# EAGLE design Dynamug PCB Final Draft (EAGLE 9.6.2)
AUTHOR: Lucas and Garret; BOARD_NAME: Final PCB Draft; DOC_NUM: 1; PROJECT_NAME: DYNAMUG; REVISION: 1.1
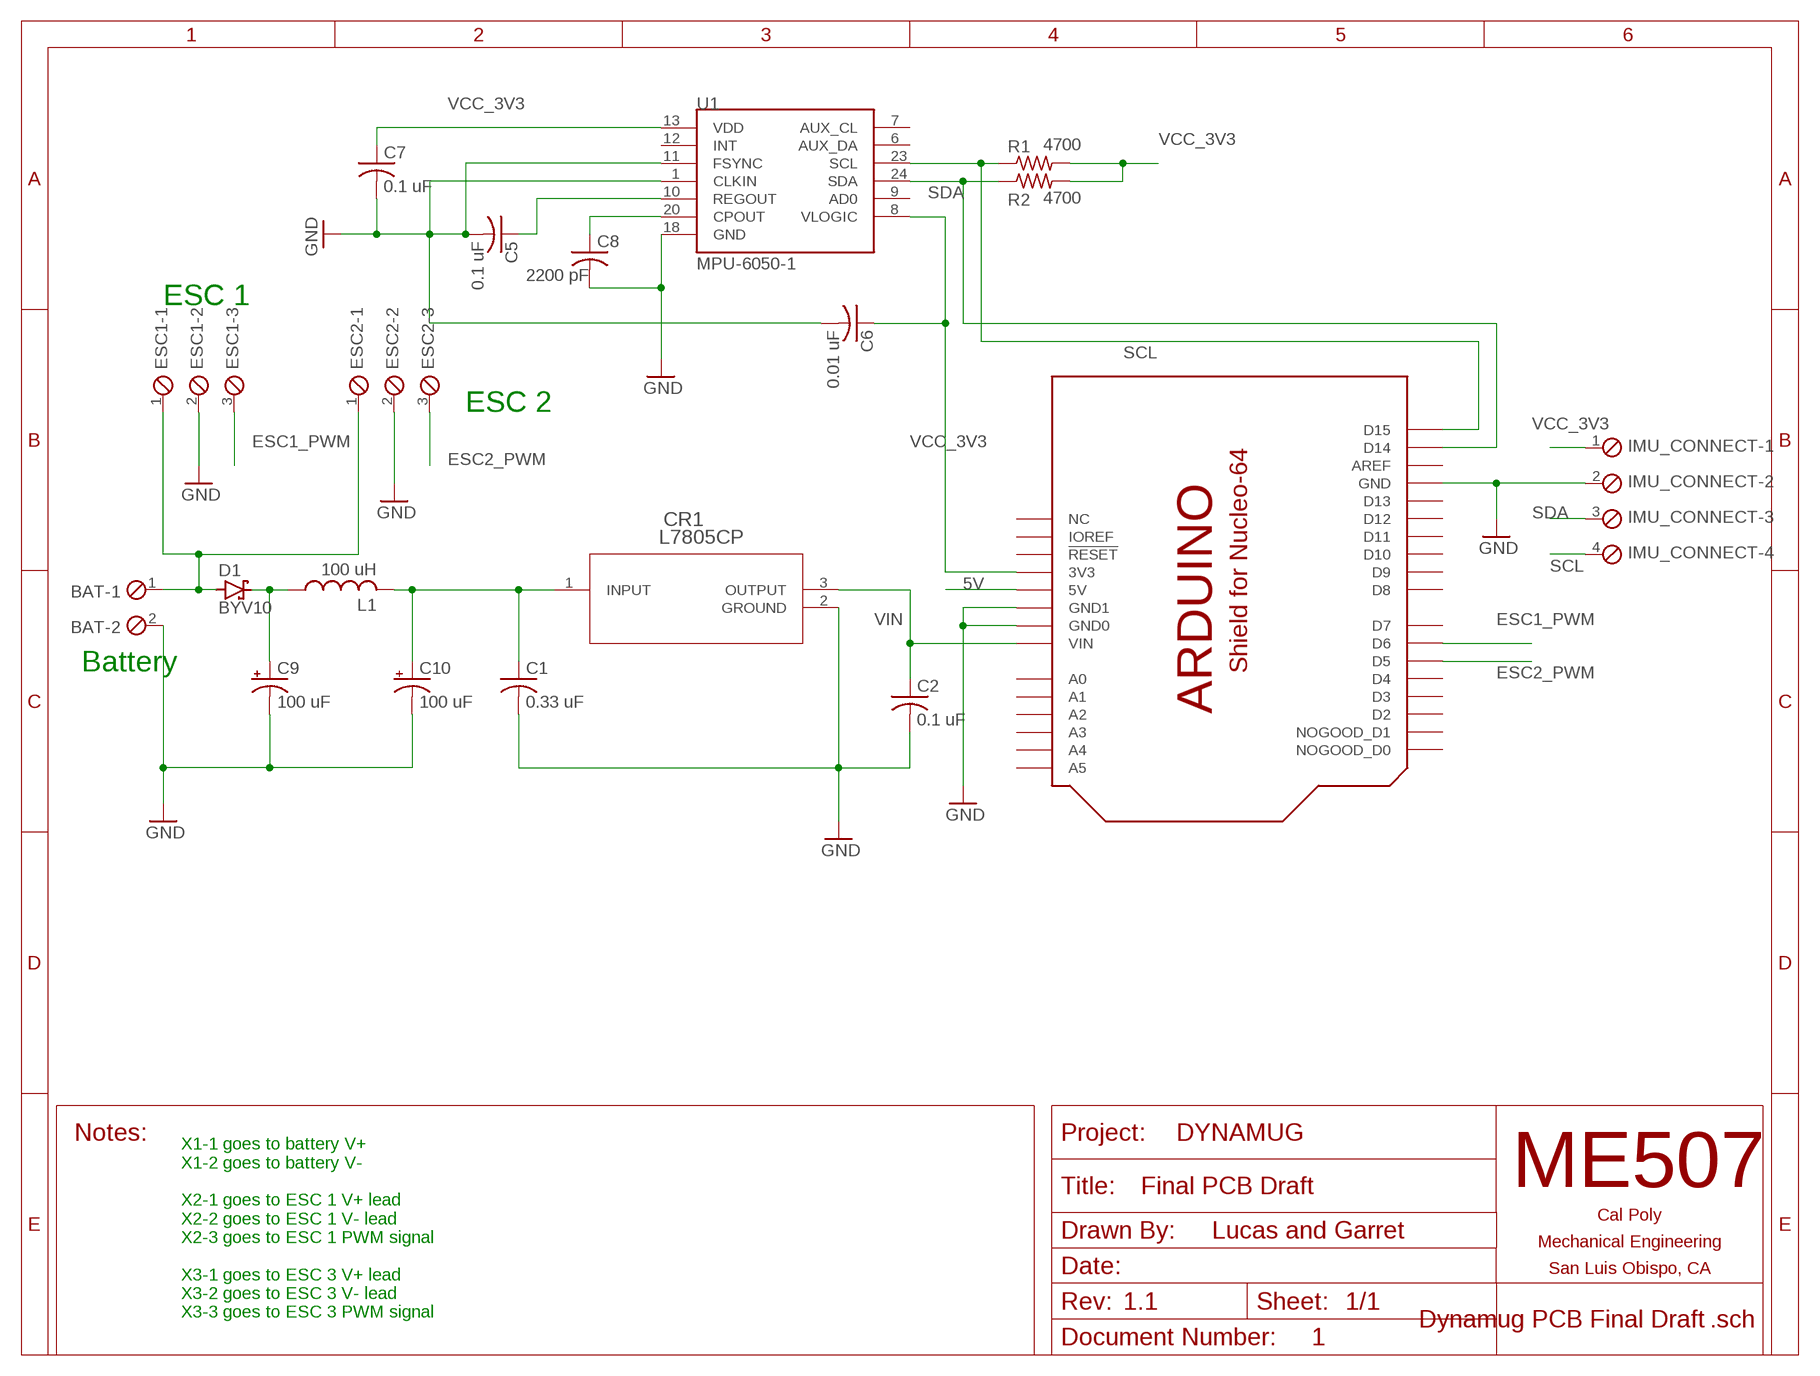
[diagram p0: schematic, sheet 1]

## Parts
BAT  SCREWTERM_2P_381  [2POL381]
C1  0.33 uF  C-USC0805  [C0805]
C2  0.1 uF  C-USC0805  [C0805]
C5  0.1 uF  C-USC0805  [C0805]
C6  0.01 uF  C-USC0805  [C0805]
C7  0.1 uF  C-USC0805  [C0805]
C8  2200 pF  C-USC0805  [C0805]
C9  100 uF  CPOL-USE2.5-6  [E2,5-6]
C10  100 uF  CPOL-USE2.5-6  [E2,5-6]
CR1  L7805CP  [TO-220FP_STM]
D1  BYV10  [DO41-10]
ESC1  SCREWTERM_3P_381  [3POL381]
ESC2  SCREWTERM_3P_381  [3POL381]
IMU_CONNECT  SCREWTERM_4P_381  [4POL381]
L1  100 uH  L-USLAL03  [LAL03]
R1  4700  R-US_R2010  [R2010]
R2  4700  R-US_R2010  [R2010]
U1  MPU-6050-1  [QFN-24-4MM2]
U$1  SHIELD_FOR_NUCLE0_64_SHORT  [SHIELD_FOR_NUCLEO_64_SHORT]

## Nets
5V: U$1.5V
ESC1_PWM: ESC1.3 U$1.D6
ESC2_PWM: ESC2.3 U$1.D5
GND: BAT.2 C1.2 C2.2 C5.2 C6.2 C7.2 C8.2 C9.- C10.- CR1.2(GROUND) ESC1.2 ESC2.2 IMU_CONNECT.2 U1.1(CLKIN) U1.11(FSYNC) U1.18(GND) U$1.GND U$1.GND1(GND0) U$1.GND2(GND1)
N$1: C1.1 C10.+ CR1.1(INPUT) L1.2
N$2: C9.+ D1.C L1.1
N$4: C5.1 U1.10(REGOUT)
N$5: C8.1 U1.20(CPOUT)
SCL: IMU_CONNECT.4 R1.1 U1.23(SCL) U$1.D15
SDA: IMU_CONNECT.3 R2.1 U1.24(SDA) U$1.D14
V_BAT: BAT.1 D1.A ESC1.1 ESC2.1
VCC_3V3: C6.1 C7.1 IMU_CONNECT.1 R1.2 R2.2 U1.8(VLOGIC) U1.13(VDD) U$1.3V(3V3)
VIN: C2.1 CR1.3(OUTPUT) U$1.VIN
Unconnected: U1.6(AUX_DA) U1.7(AUX_CL) U1.9(AD0) U1.12(INT) U$1.A0 U$1.A1 U$1.A2 U$1.A3 U$1.A4 U$1.A5 U$1.AREF U$1.D0(NOGOOD_D0) U$1.D1(NOGOOD_D1) U$1.D2 U$1.D3 U$1.D4 U$1.D7 U$1.D8 U$1.D9 U$1.D10 U$1.D11 U$1.D12 U$1.D13 U$1.IOREF U$1.NC U$1.NRST(!RESET)

## Notes on the sheet
- ESC 1
- ESC 2
- Battery
- X1-1 goes to battery V+
  X1-2 goes to battery V-
  
  X2-1 goes to ESC 1 V+ lead
  X2-2 goes to ESC 1 V- lead
  X2-3 goes to ESC 1 PWM signal
  
  X3-1 goes to ESC 3 V+ lead
  X3-2 goes to ESC 3 V- lead
  X3-3 goes to ESC 3 PWM signal

## Library data of the parts
BAT = ME507:SCREWTERM_2P: Screw Terminal Block This part is designed for a screw terminal connector. The 2.54mm (0.100 inch) foorprint can also be used for male or female pin headers such as those on most development boards. One can also solder wires directly into the holes, though this makes modifications or repairs to the system more inconvenient. Larger versions can carry more current.
C1 C2 C5-C8 = rcl:C-US: CAPACITOR, American symbol; SPICEPREFIX: C
C9 C10 = rcl:CPOL-US: POLARIZED CAPACITOR, American symbol; SPICEPREFIX: C
CR1 = LM7805:L7805CP; COPYRIGHT: Copyright (C) 2021 Ultra Librarian. All rights reserved.; MANUFACTURER_PART_NUMBER: L7805CP; MFR_NAME: STMicroelectronics
D1 = diode:BYV10: DIODE power diode
ESC1 ESC2 = ME507:SCREWTERM_3P: Screw Terminal Block This part is designed for a screw terminal connector. The 2.54mm (0.100 inch) foorprint can also be used for male or female pin headers such as those on most development boards. One can also solder wires directly into the holes, though this makes modifications or repairs to the system more inconvenient. Larger versions can carry more current.
IMU_CONNECT = ME507:SCREWTERM_4P: Screw Terminal Block This part is designed for a screw terminal connector. The 2.54mm (0.100 inch) foorprint can also be used for male or female pin headers such as those on most development boards. One can also solder wires directly into the holes, though this makes modifications or repairs to the system more inconvenient. Larger versions can carry more current.
L1 = rcl:L-US: INDUCTOR, American symbol; SPICEPREFIX: L
R1 R2 = rcl:R-US_: RESISTOR, American symbol; SPICEPREFIX: R
U1 = Testing:MPU-6050
U$1 = ME507:SHIELD_FOR_NUCLE0_64: Arduino Style Shield for Nucleo-64 This is a board outline with pin locations for an Arduino style shield which fits on top of an STM32 Nucleo-64. Pin names are generic except for Nucleo specific pins such as IOREF. There are two board sizes, the standard which matches the size of an Arduino Uno, and the short version which can be less expensive to produce if you don't need a lot of board area. The outline is on the DIMENSION layer. When making a new board, you must delete the lines which form the default board outline so that this package's outlines control the dimensions of the board. Pins D0 and D1 are connected to a communications port and are not available for general use, so they are labeled as NOGOOD on the symbol and footprints.

## Board
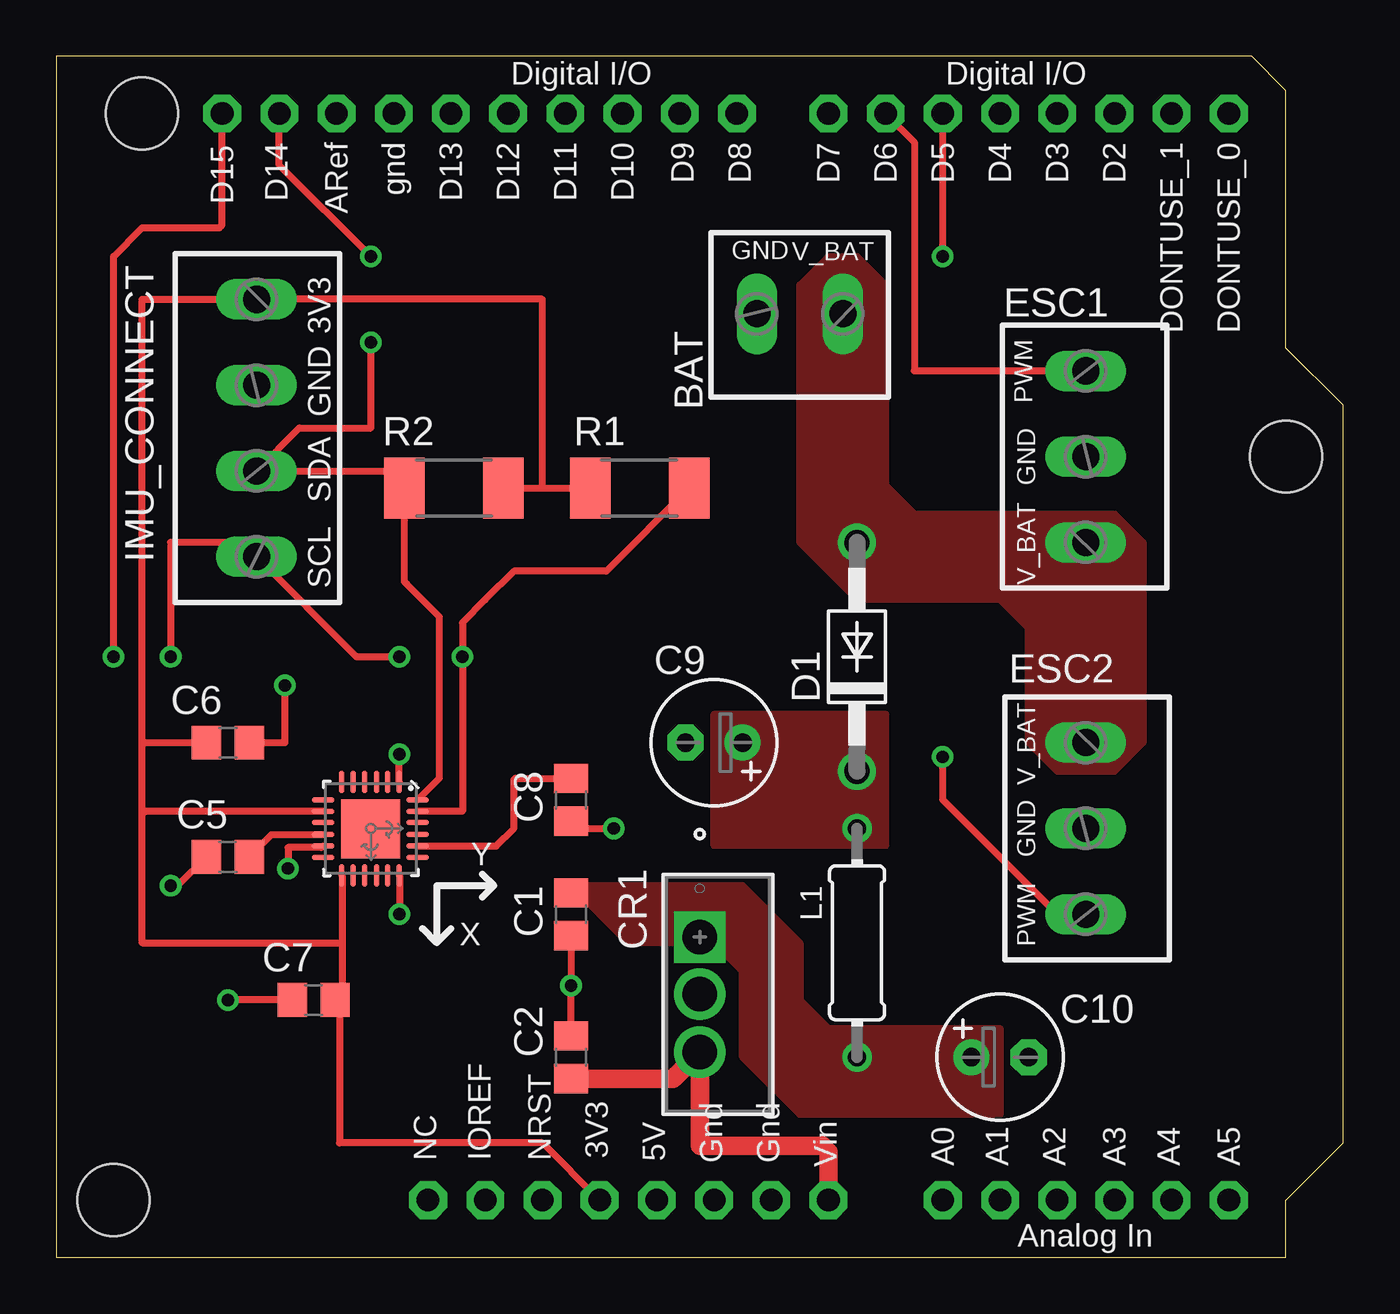
[diagram p1: board, top side]
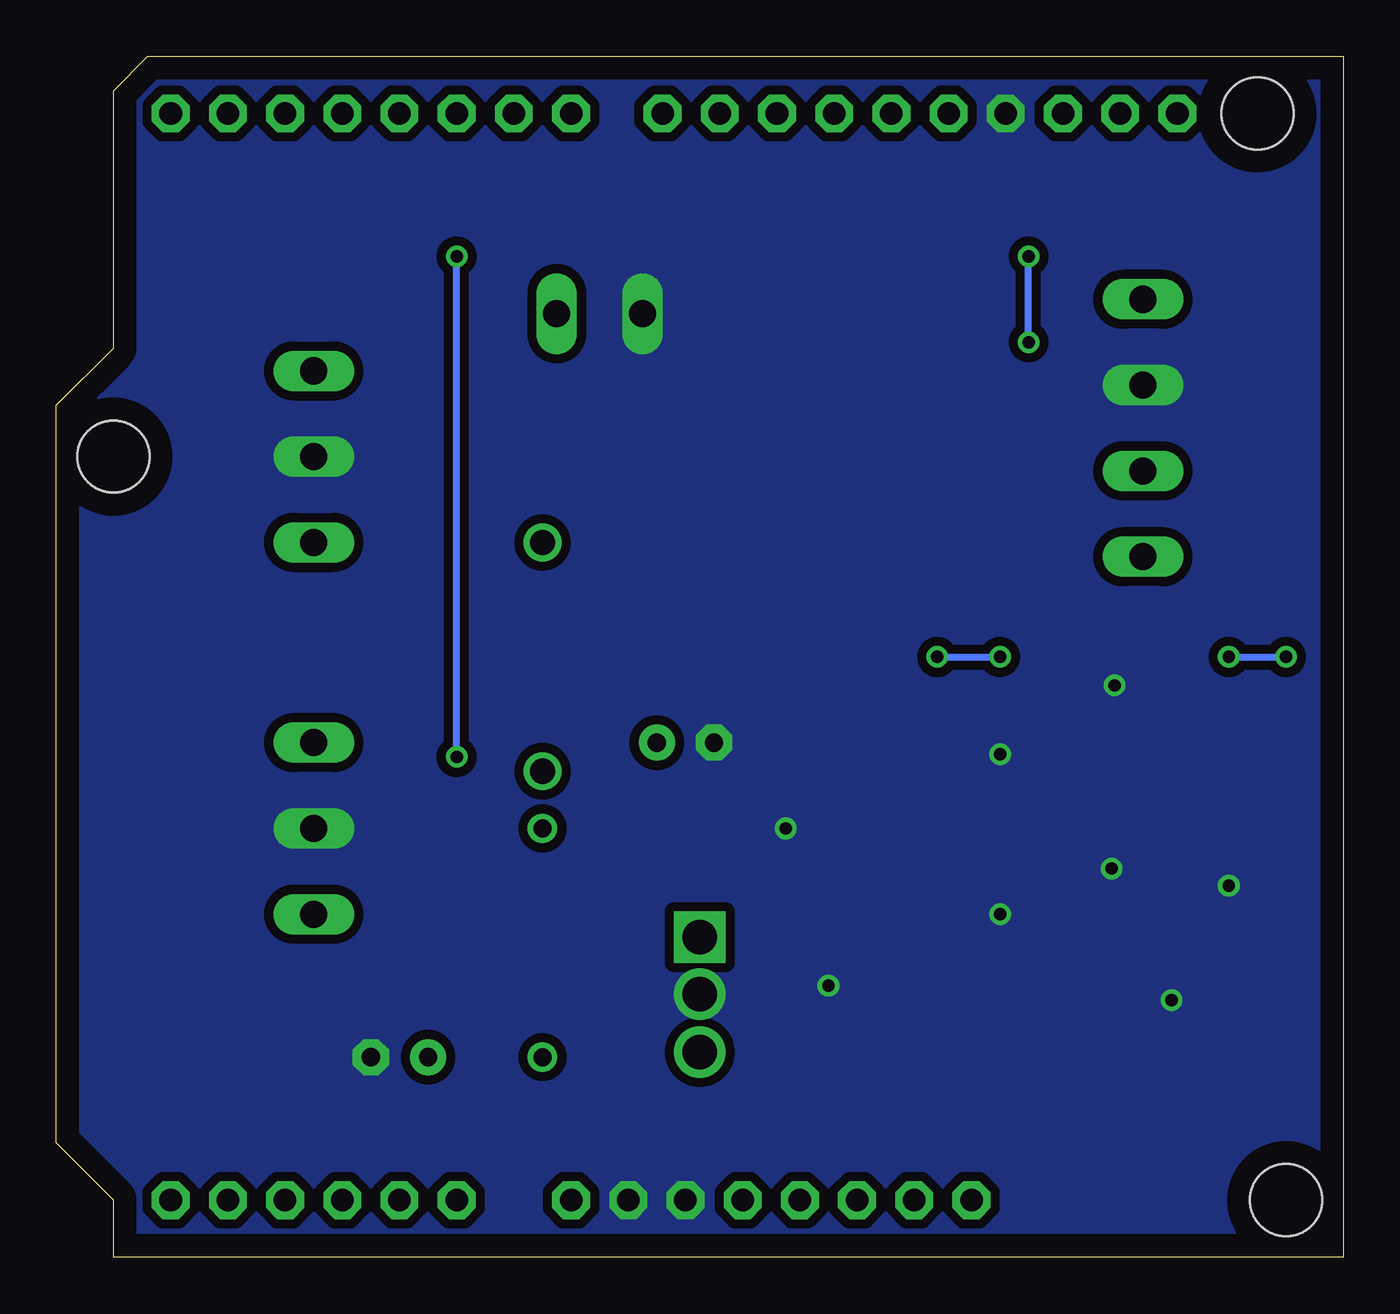
[diagram p2: board, bottom side, seen from below]

Size 57.15 x 53.34 mm. Coordinates in mm from the lower left corner, seen from the top.
Copper layers (1*16): Top 0.035mm / dielectric 1.5mm / Bottom 0.035mm
Design rules "default": minimum track width 6mil, minimum drill 0.35mm, track to track 6mil, track to pad 6mil, pad to pad 6mil, via to via 6mil, smd to smd 6mil, copper to edge 40mil, drill to drill 6mil, minimum pad ring 10mil, minimum via ring 8mil, stop-mask expansion 4mil, vias tented up to drill 0mil, thermal gap 10mil

### Footprints (pad centres in the part's own frame; a part is rotated, then mirrored left to right if it is on the bottom)
2POL381 = drill 1.2 long: 1 -1.905,0; 2 1.905,0
C0805 = smd 1.3 x 1.5: 1 -0.95,0; 2 0.95,0
E2,5-6 = drill 0.813 pad 1.6: + -1.27,0 | drill 0.813 pad 1.6 octagon: - 1.27,0
TO-220FP_STM = drill 1.524 pad 2.032 square: 1 0,0 | drill 1.524 pad 2.032: 2 2.54,0; 3 5.105,0
DO41-10 = drill 1.118: A 5.08,0; C -5.08,0
3POL381 = drill 1.2 long: 1 -3.81,0; 2 0,0; 3 3.81,0
4POL381 = drill 1.2 long: 1 -5.715,0; 2 -1.905,0; 3 1.905,0; 4 5.715,0
LAL03 = drill 0.8 pad 1.3: 1 -5.08,0; 2 5.08,0
R2010 = smd 1.8 x 2.7: 1 -2.2,0; 2 2.2,0
QFN-24-4MM2 = smd 1.016 x 0.254: 1 -2.066,1.257; 2 -2.066,0.75; 3 -2.066,0.247; 4 -2.066,-0.287; 5 -2.066,-0.792; 6 -2.066,-1.297; 13 2.086,-1.297; 14 2.086,-0.792; 15 2.086,-0.287; 16 2.086,0.247; 17 2.086,0.75; 18 2.086,1.257 | smd 0.254 x 1.016: 7 -1.267,-2.122; 8 -0.762,-2.122; 9 -0.258,-2.122; 10 0.278,-2.122; 11 0.78,-2.122; 12 1.287,-2.122; 19 1.287,2.082; 20 0.78,2.082; 21 0.278,2.082; 22 -0.258,2.082; 23 -0.762,2.082; 24 -1.267,2.082 | smd 2.616 x 2.616: P$1 0.02,-0.01
SHIELD_FOR_NUCLEO_64_SHORT = drill 1 pad 1.676 octagon: 3V 35.56,2.54; 5V 38.1,2.54; A0 50.8,2.54; A1 53.34,2.54; A2 55.88,2.54; A3 58.42,2.54; A4 60.96,2.54; A5 63.5,2.54; AREF 23.876,50.8; D0 63.5,50.8; D1 60.96,50.8; D2 58.42,50.8; D3 55.88,50.8; D4 53.34,50.8; D5 50.8,50.8; D6 48.26,50.8; D7 45.72,50.8; D8 41.656,50.8; D9 39.116,50.8; D10 36.576,50.8; D11 34.036,50.8; D12 31.496,50.8; D13 28.956,50.8; D14 21.336,50.8; D15 18.796,50.8; GND 26.416,50.8; GND1 43.18,2.54; GND2 40.64,2.54; IOREF 30.48,2.54; NC 27.94,2.54; NRST 33.02,2.54; VIN 45.72,2.54 | hole 3.2: 15.24,50.8; 66.04,35.56; 13.97,2.54

### Placement (x,y rotation side)
BAT  33.02,41.91 180 top
C1  22.86,15.24 270 top
C2  22.86,8.89 90 top
C5  7.62,17.78 180 top
C6  7.62,22.86 0 top
C7  11.43,11.43 180 top
C8  22.86,20.32 270 top
C9  29.21,22.86 180 top
C10  41.91,8.89 0 top
CR1  28.58,14.22 270 top
D1  35.56,26.67 90 top
ESC1  45.72,35.56 90 top
ESC2  45.72,19.05 270 top
IMU_CONNECT  8.89,36.83 270 top
L1  35.56,13.97 270 top
R1  25.91,34.16 180 top
R2  17.65,34.16 0 top
U1  13.97,19.05 270 top
U$1  -11.43,0 0 top

### Tracks (layer width: path | path; a pad name or v marks a point on that pad's centre or on a via)
ESC1_PWM
  Top 0.305: ESC1.3 38.1,39.37 38.1,49.53 U$1.D6
ESC2_PWM  (via drill 0.55)
  Top 0.305: v39.37,44.45 U$1.D5 | ESC2.3 44.45,15.24 39.37,20.32 v39.37,22.23
  Bottom 0.305: v39.37,22.23 v39.37,44.45
GND  (via drill 0.55)
  Top 0.305: C7.2 v7.62,11.43 | C5.2 5.4,16.51 v5.08,16.51 | 8.89,23.18 C6.2 10.16,22.86 v10.16,25.4 | U1.18 v15.24,15.24 | U1.11 11.77,18.2 10.29,18.2 v10.29,17.27 | U1.1 15.23,22.34 v15.24,22.35 | C8.2 23.18,19.05 v24.77,19.05 | C2.2 v22.86,12.06 C1.2
  pour Bottom (isolate 0.406, no thermals): 0,53.34 53.34,53.34 54.61,52.07 54.61,40.64 57.15,38.1 57.15,5.08 54.61,2.54 54.61,0 0,0
N$1
  pour Top (no thermals): 22.86,16.51 30.48,16.51 33.02,13.97 33.02,11.43 34.29,10.16 41.91,10.16 41.91,6.35 33.02,6.35 30.48,8.89 30.48,12.7 29.21,13.97 25.4,13.97
N$2
  pour Top (no thermals): 29.21,24.13 36.83,24.13 36.83,18.29 29.21,18.29
N$4
  Top 0.305: C5.1 9.56,18.77 U1.10
N$5
  Top 0.305: U1.20 19.54,18.27 20.32,19.05 20.32,21.21 20.38,21.27 C8.1
SCL  (via drill 0.55)
  Top 0.305: R1.1 24.42,30.48 20.32,30.48 19.05,29.21 18.03,28.19 v18.03,26.67 18.03,19.81 U1.23 | U1.23 | v15.24,26.67 13.34,26.67 IMU_CONNECT.4 8.25,31.75 5.08,31.75 v5.08,26.67 | v2.54,26.67 2.54,44.45 3.81,45.72 7.24,45.72 7.37,45.85 U$1.D15
  Bottom 0.305: v18.03,26.67 v15.24,26.67 | v5.08,26.67 v2.54,26.67
SDA  (via drill 0.55)
  Top 0.305: U1.24 17.02,21.28 17.02,28.45 15.56,29.91 15.45,30.01 R2.1 14.69,34.93 IMU_CONNECT.3 10.79,36.83 13.97,36.83 v13.97,40.64 | U$1.D14 9.91,48.51 v13.97,44.45
  Bottom 0.305: v13.97,40.64 v13.97,44.45
V_BAT
  pour Top (no thermals): 33.02,43.18 34.29,44.45 35.56,44.45 36.83,43.18 36.83,34.29 38.1,33.02 46.99,33.02 48.26,31.75 48.26,22.86 46.99,21.59 44.45,21.59 43.18,22.86 43.18,27.94 41.91,29.21 35.56,29.21 33.02,31.75
VCC_3V3
  Top 0.305: 12.7,13.97 3.81,13.97 3.81,19.69 | 3.81,19.69 3.81,22.86 | 3.81,22.86 C6.1 | U$1.3V 21.59,5.08 12.57,5.08 12.57,11.24 C7.1 12.7,11.75 12.7,13.97 | R2.2 21.59,34.16 | 21.59,34.16 21.59,42.55 IMU_CONNECT.1 3.81,42.55 3.81,22.86 | U1.8 3.94,19.81 3.81,19.69 | U1.13 12.7,16.94 12.7,13.97 | 21.59,34.16 R1.2
VIN
  Top 0.813: C2.1 27.4,7.94 CR1.3 28.58,4.95 34.04,4.95 34.29,4.7 U$1.VIN

### Text on the board
tNames: V_BAT | 3V3 | GND | PWM | GND | GND | SDA | V_BAT | SCL | V_BAT | GND | Y | PWM | X